# Altium schematic sheet lpf6.SchDoc: mcHF QRP Transceiver RF board
size A4; Author: K Atanassov; CompanyName: M0NKA; Revision: 0.6.3; SheetTotal: 12
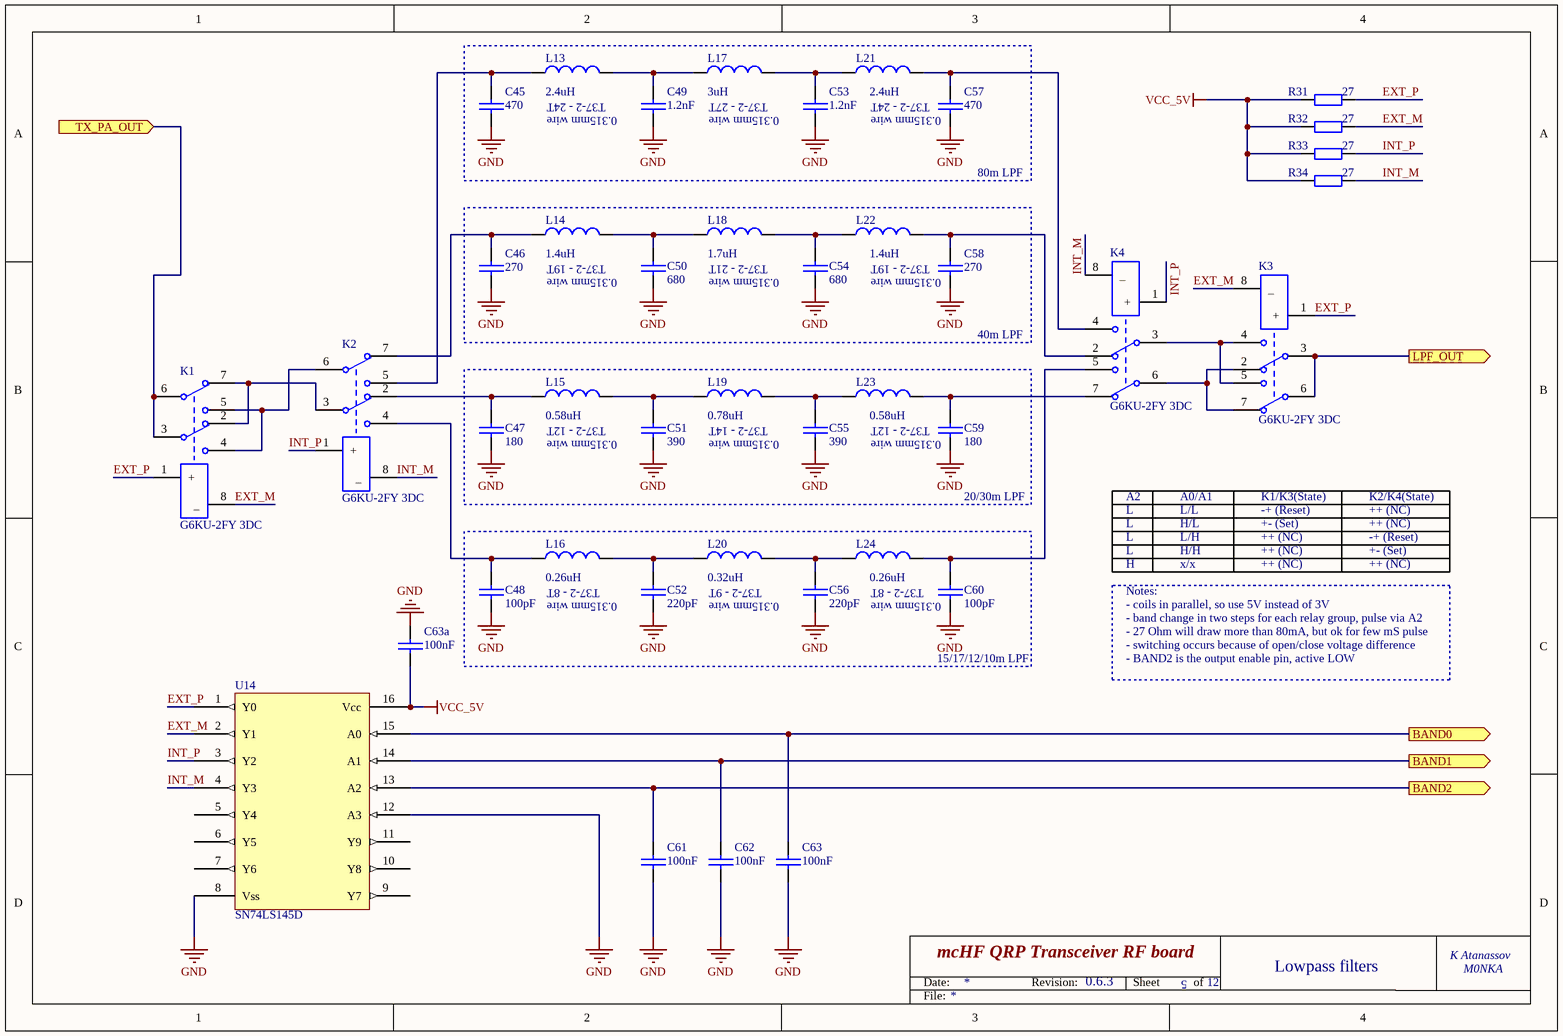
[diagram p0: lpf6.SchDoc]

## Parts
C45  470  [0805-Pro]
C46  270  [0805-Pro]
C47  180  [0805-Pro]
C48  100pF  [0805-Pro]
C49  1.2nF  [0805-Pro]
C50  680  [0805-Pro]
C51  390  [0805-Pro]
C52  220pF  [0805-Pro]
C53  1.2nF  [0805-Pro]
C54  680  [0805-Pro]
C55  390  [0805-Pro]
C56  220pF  [0805-Pro]
C57  470  [0805-Pro]
C58  270  [0805-Pro]
C59  180  [0805-Pro]
C60  100pF  [0805-Pro]
C61  100nF  [0805-Pro]
C62  100nF  [0805-Pro]
C63  100nF  [0805-Pro]
C63a  100nF  [0805-Pro]
K1  G6KU-2FY 3DC  [Omron_2FY]
K2  G6KU-2FY 3DC  [Omron_2FY]
K3  G6KU-2FY 3DC  [Omron_2FY]
K4  G6KU-2FY 3DC  [Omron_2FY]
L13  Inductance: 2.4uH  [LPF_IND]  (hidden comment: T37-2)
L14  Inductance: 1.4uH  [LPF_IND]  (hidden comment: T37-2)
L15  Inductance: 0.58uH  [LPF_IND]  (hidden comment: T37-2)
L16  Inductance: 0.26uH  [LPF_IND]  (hidden comment: T37-2)
L17  Inductance: 3uH  [LPF_IND]  (hidden comment: T37-2)
L18  Inductance: 1.7uH  [LPF_IND]  (hidden comment: T37-2)
L19  Inductance: 0.78uH  [LPF_IND]  (hidden comment: T37-2)
L20  Inductance: 0.32uH  [LPF_IND]  (hidden comment: T37-2)
L21  Inductance: 2.4uH  [LPF_IND]  (hidden comment: T37-2)
L22  Inductance: 1.4uH  [LPF_IND]  (hidden comment: T37-2)
L23  Inductance: 0.58uH  [LPF_IND]  (hidden comment: T37-2)
L24  Inductance: 0.26uH  [LPF_IND]  (hidden comment: T37-2)
R31  27  [1206]
R32  27  [1206]
R33  27  [1206]
R34  27  [1206]
U14  SN74LS145D  [SO-16-Pro]

## Ports
BAND0 (out), BAND1 (out), BAND2 (out), LPF_OUT (out), TX_PA_OUT (in)

## Nets
GND: C45.2 C46.2 C47.1 C48.1 C49.2 C50.1 C51.1 C52.1 C53.2 C54.1 C55.1 C56.1 C57.2 C58.2 C59.1 C60.1 C61.1 C62.1 C63.1 C63a.2 U14.8(Vss) U14.12(A3)
VCC_5V: C63a.1 R31.2 R32.2 R33.2 R34.2 U14.16(Vcc)
BAND0: C63.2 U14.15(A0) ; port BAND0
BAND1: C62.2 U14.14(A1) ; port BAND1
BAND2: C61.2 U14.13(A2) ; port BAND2
EXT_M: K1.8(_) K3.8(_) R32.1 U14.2(Y1)
EXT_P: K1.1(+) K3.1(+) R31.1 U14.1(Y0)
INT_M: K2.8(_) K4.8(_) R34.1 U14.4(Y3)
INT_P: K2.1(+) K4.1(+) R33.1 U14.3(Y2)
LPF_OUT: K3.3 K3.6 ; port LPF_OUT
TX_PA_OUT: K1.3 K1.6 ; port TX_PA_OUT
NetC45_1: C45.1 K2.5 L13.1
NetC46_1: C46.1 K2.7 L14.1
NetC47_2: C47.2 K2.2 L15.1
NetC48_2: C48.2 K2.4 L16.1
NetC49_1: C49.1 L13.2 L17.1
NetC50_2: C50.2 L14.2 L18.1
NetC51_2: C51.2 L15.2 L19.1
NetC52_2: C52.2 L16.2 L20.1
NetC53_1: C53.1 L17.2 L21.1
NetC54_2: C54.2 L18.2 L22.1
NetC55_2: C55.2 L19.2 L23.1
NetC56_2: C56.2 L20.2 L24.1
NetC57_1: C57.1 K4.4 L21.2
NetC58_1: C58.1 K4.2 L22.2
NetC59_2: C59.2 K4.7 L23.2
NetC60_2: C60.2 K4.5 L24.2
NetK1_2: K1.2 K1.7 K2.3
NetK1_4: K1.4 K1.5 K2.6
NetK3_2: K3.2 K3.7 K4.6
NetK3_4: K3.4 K3.5 K4.3

Not connected (* = marked no-connect by the designer): U14 5(Y4) 6(Y5) 7(Y6) 9(Y7) 10(Y8) 11(Y9)

## Notes on the sheet
- T37-2 - 24T
- 0.315mm wire
- T37-2 - 27T
- (near C57) T37-2 - 24T
- (near C57) 0.315mm wire
- 80m LPF
- T37-2 - 19T
- T37-2 - 21T
- (near C58) T37-2 - 19T
- (near C58) 0.315mm wire
- 40m LPF
- T37-2 - 12T
- T37-2 - 14T
- (near C59) T37-2 - 12T
- (near C59) 0.315mm wire
- 20/30m LPF
- A2
- L
- L/L
- A0/A1
- K1/K3(State)
- -+ (Reset)
- K2/K4(State)
- ++ (NC)
- (near L16) T37-2 - 8T
- (near L20) T37-2 - 9T
- T37-2 - 8T
- H
- L/H
- H/H
- H/L
- x/x
- +- (Set)
- (near C60) 0.315mm wire
- - coils in parallel, so use 5V instead of 3V
- - band change in two steps for each relay group, pulse via A2
- - 27 Ohm will draw more than 80mA, but ok for few mS pulse
- Notes:
- - switching occurs because of open/close voltage difference
- 15/17/12/10m LPF
- - BAND2 is the output enable pin, active LOW
- 5
- Lowpass filters
- Date:
- Revision:
- Sheet
- of
- File:

## Library data of the parts
C45 C57 = CAP: Capacitor; Order: FN 141-4693; Price: 0.063
C46 C58 = CAP: Capacitor; Order: FN 233-2698; Price: 0.078
C47 C59 = CAP: Capacitor; Order: FN 233-2756; QT Order: QCC-00084; Price: 0.058
C48 C60 = CAP: Capacitor; Order: FN 233-2692; Price: 0.056
C49 C53 = CAP: Capacitor; Order: FN 221-0933; Price: 0.143
C50 C54 = CAP: Capacitor; Order: FN 228-0662; Price: 0.074
C51 C55 = CAP: Capacitor; Order: FN 233-2701; QT Order: QCC-00125; Price: 0.078
C52 C56 = CAP: Capacitor; Order: FN 498-609; Price: 0.068
C61-C63 C63a = CAP: Capacitor; Order: FN 252-2090; QT Order: QCC-00154; Price: 0.068
K1-K4 = G6KU-2FY 3DC: Single-winding Latching Relay; Order: FN 118-1070; Price: 2.19
L13-L24 = LPF_IND: T37-2 handwound inductor; Order: EB 400348182316; Price: 0.20
R31-R34 = RES: Resistor; Order: FN 205-7802; QT Order: QCR-00427; Price: 0.017
U14 = SN74LS145D: BCD DECODER/DRIVER; Order: FN 959-2300; Price: 1.22